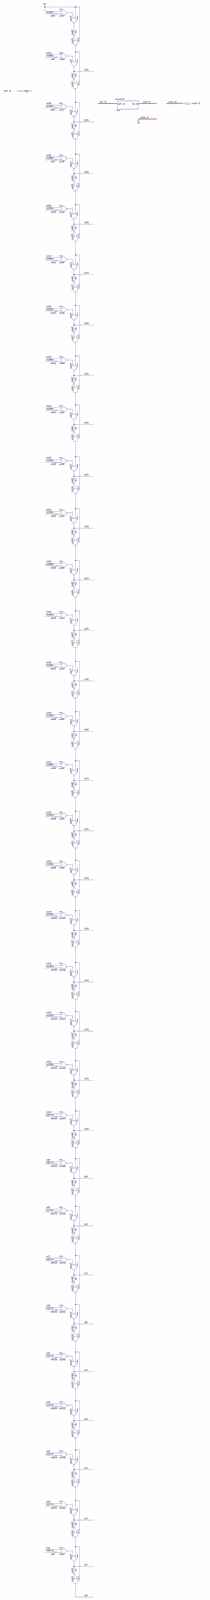
[diagram p0: schematic sheet, whole]
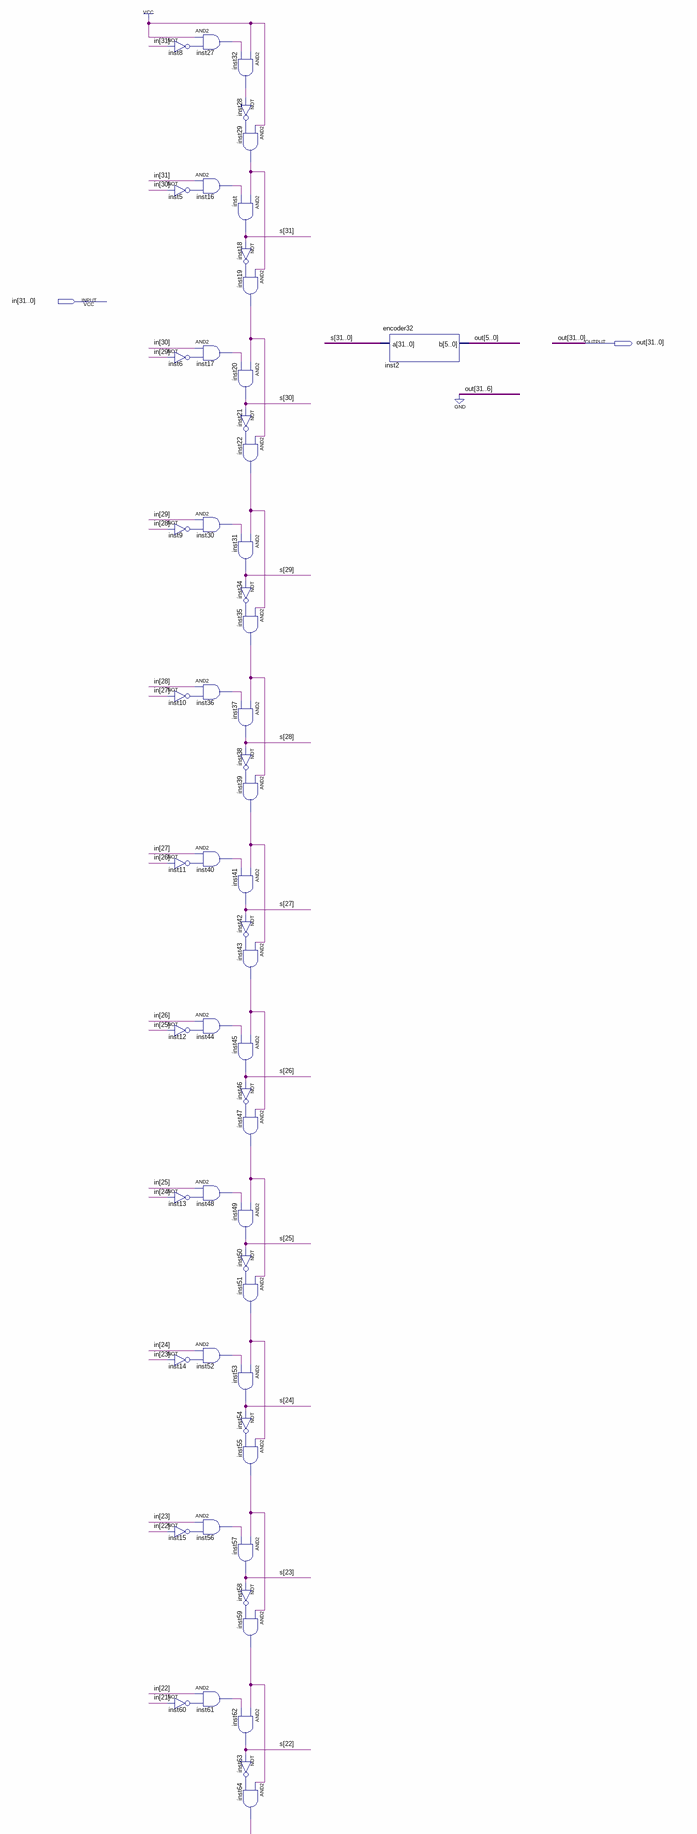
[diagram p1: schematic sheet, upper part]
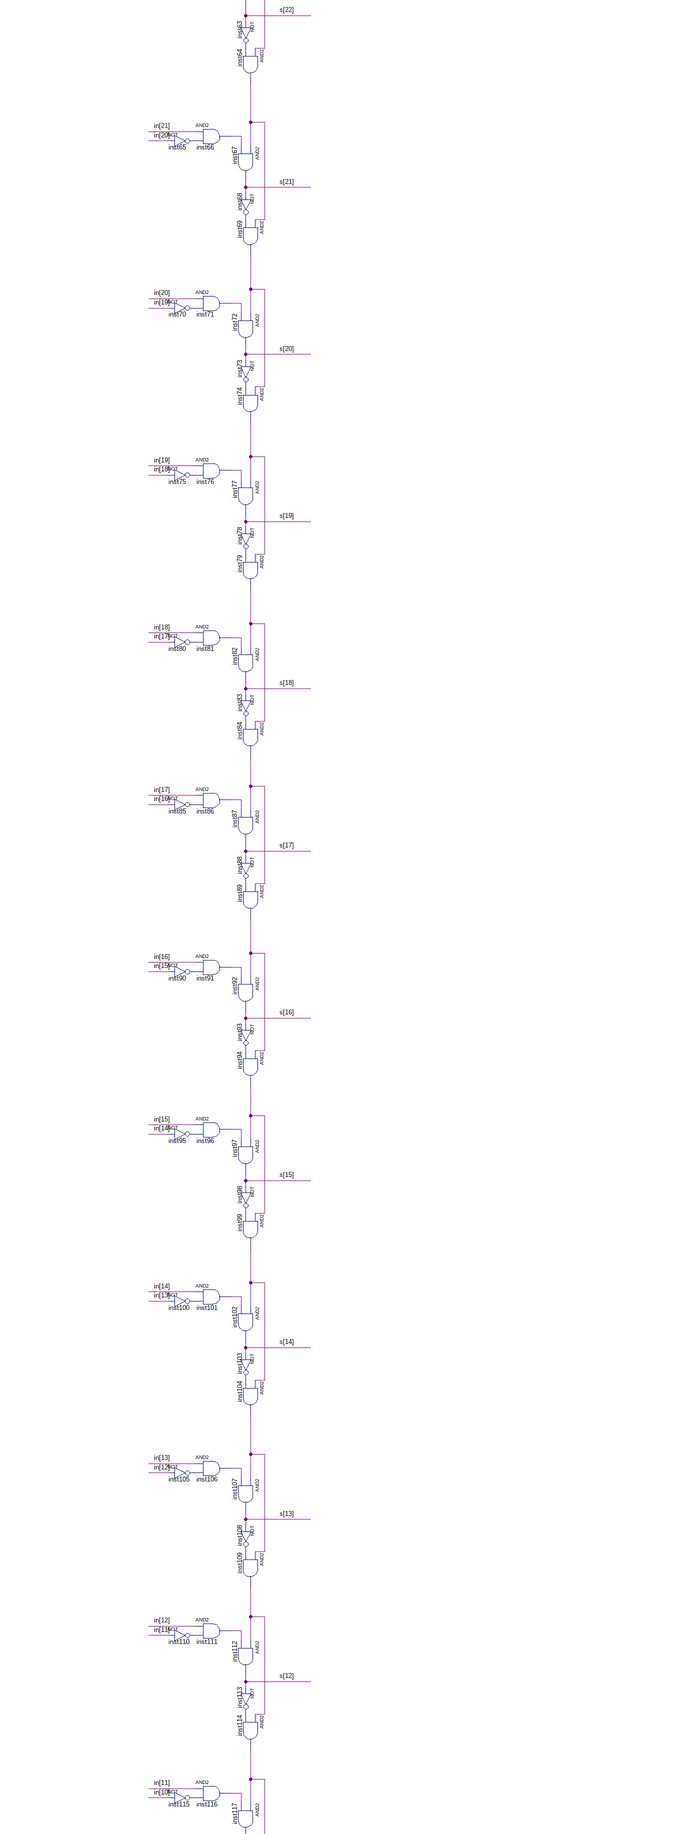
[diagram p2: schematic sheet, middle part]
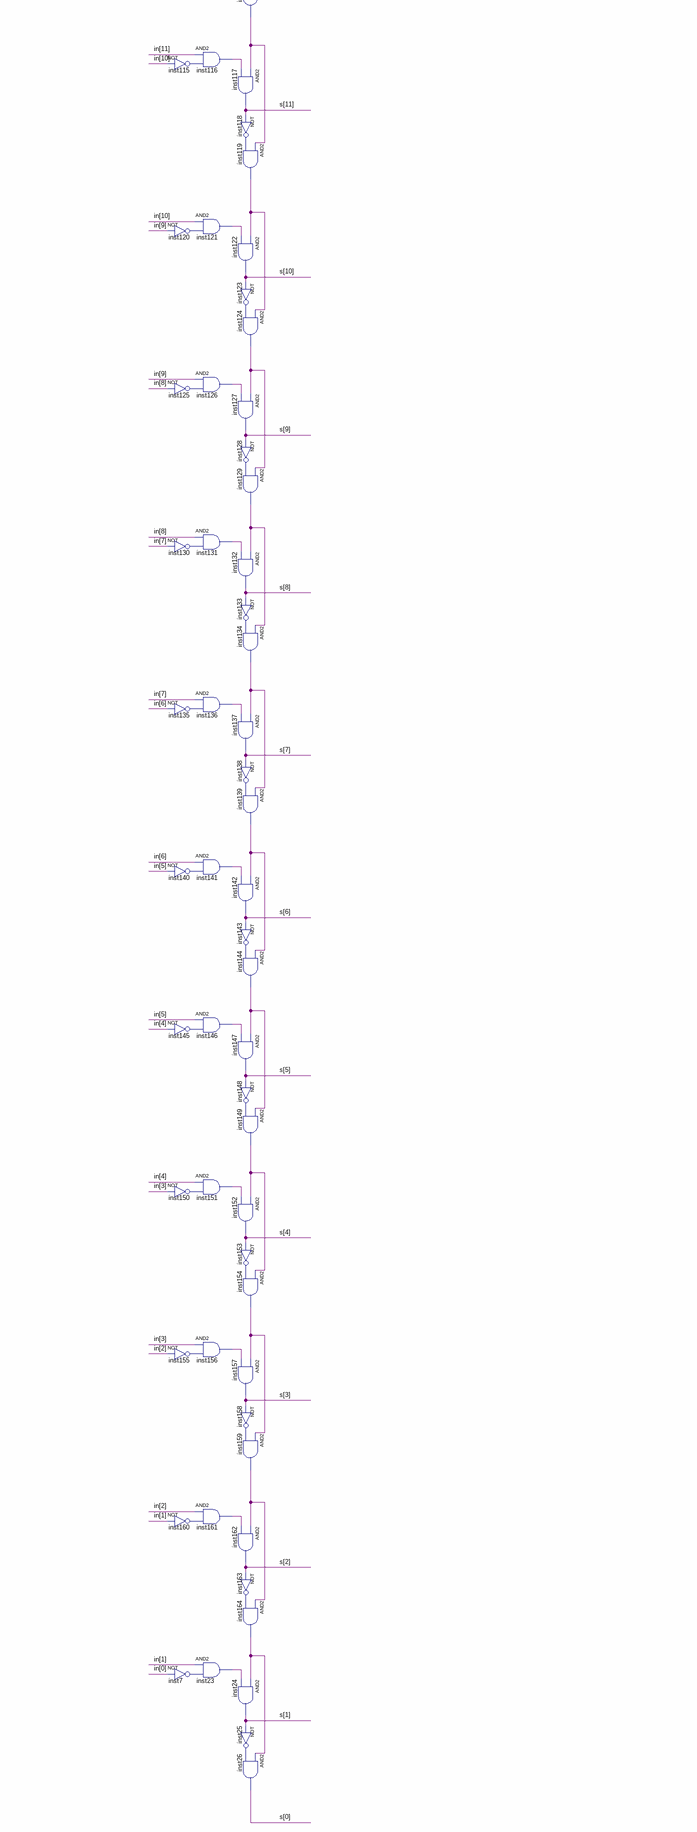
[diagram p3: schematic sheet, lower part]
// Quartus schematic clo.bdf as structural Verilog: 161 symbols, 2 pins
module clo (
  input  [31:0] in,
  output [31:0] out
);

  wire inst5_out, inst6_out, inst7_out, inst8_out, inst9_out, inst10_out, inst11_out, inst12_out, inst13_out,
       inst14_out, inst15_out, inst16_out, inst17_out, inst18_out, inst19_out, inst21_out, inst22_out,
       inst23_out, inst25_out, inst27_out, inst28_out, inst29_out, inst30_out, inst32_out, inst34_out,
       inst35_out, inst36_out, inst38_out, inst39_out, inst40_out, inst42_out, inst43_out, inst44_out,
       inst46_out, inst47_out, inst48_out, inst50_out, inst51_out, inst52_out, inst54_out, inst55_out,
       inst56_out, inst58_out, inst59_out, inst60_out, inst61_out, inst63_out, inst64_out, inst65_out,
       inst66_out, inst68_out, inst69_out, inst70_out, inst71_out, inst73_out, inst74_out, inst75_out,
       inst76_out, inst78_out, inst79_out, inst80_out, inst81_out, inst83_out, inst84_out, inst85_out,
       inst86_out, inst88_out, inst89_out, inst90_out, inst91_out, inst93_out, inst94_out, inst95_out,
       inst96_out, inst98_out, inst99_out, inst100_out, inst101_out, inst103_out, inst104_out, inst105_out,
       inst106_out, inst108_out, inst109_out, inst110_out, inst111_out, inst113_out, inst114_out,
       inst115_out, inst116_out, inst118_out, inst119_out, inst120_out, inst121_out, inst123_out,
       inst124_out, inst125_out, inst126_out, inst128_out, inst129_out, inst130_out, inst131_out,
       inst133_out, inst134_out, inst135_out, inst136_out, inst138_out, inst139_out, inst140_out,
       inst141_out, inst143_out, inst144_out, inst145_out, inst146_out, inst148_out, inst149_out,
       inst150_out, inst151_out, inst153_out, inst154_out, inst155_out, inst156_out, inst158_out,
       inst159_out, inst160_out, inst161_out, inst163_out, inst164_out;
  wire [31:0] s;

  not inst8 (inst8_out, in[31]);
  not inst5 (inst5_out, in[30]);
  not inst6 (inst6_out, in[29]);
  not inst9 (inst9_out, in[28]);
  not inst10 (inst10_out, in[27]);
  not inst11 (inst11_out, in[26]);
  not inst12 (inst12_out, in[25]);
  not inst13 (inst13_out, in[24]);
  not inst14 (inst14_out, in[23]);
  not inst15 (inst15_out, in[22]);
  not inst60 (inst60_out, in[21]);
  not inst65 (inst65_out, in[20]);
  not inst70 (inst70_out, in[19]);
  not inst75 (inst75_out, in[18]);
  not inst80 (inst80_out, in[17]);
  not inst85 (inst85_out, in[16]);
  not inst90 (inst90_out, in[15]);
  not inst95 (inst95_out, in[14]);
  not inst100 (inst100_out, in[13]);
  not inst105 (inst105_out, in[12]);
  not inst110 (inst110_out, in[11]);
  not inst115 (inst115_out, in[10]);
  not inst120 (inst120_out, in[9]);
  not inst125 (inst125_out, in[8]);
  not inst130 (inst130_out, in[7]);
  not inst135 (inst135_out, in[6]);
  not inst140 (inst140_out, in[5]);
  not inst145 (inst145_out, in[4]);
  not inst150 (inst150_out, in[3]);
  not inst155 (inst155_out, in[2]);
  not inst160 (inst160_out, in[1]);
  not inst7 (inst7_out, in[0]);
  and inst27 (inst27_out, 1'b1, inst8_out);
  and inst16 (inst16_out, in[31], inst5_out);
  and inst17 (inst17_out, in[30], inst6_out);
  and inst30 (inst30_out, in[29], inst9_out);
  and inst36 (inst36_out, in[28], inst10_out);
  and inst40 (inst40_out, in[27], inst11_out);
  and inst44 (inst44_out, in[26], inst12_out);
  and inst48 (inst48_out, in[25], inst13_out);
  and inst52 (inst52_out, in[24], inst14_out);
  and inst56 (inst56_out, in[23], inst15_out);
  and inst61 (inst61_out, in[22], inst60_out);
  and inst66 (inst66_out, in[21], inst65_out);
  and inst71 (inst71_out, in[20], inst70_out);
  and inst76 (inst76_out, in[19], inst75_out);
  and inst81 (inst81_out, in[18], inst80_out);
  and inst86 (inst86_out, in[17], inst85_out);
  and inst91 (inst91_out, in[16], inst90_out);
  and inst96 (inst96_out, in[15], inst95_out);
  and inst101 (inst101_out, in[14], inst100_out);
  and inst106 (inst106_out, in[13], inst105_out);
  and inst111 (inst111_out, in[12], inst110_out);
  and inst116 (inst116_out, in[11], inst115_out);
  and inst121 (inst121_out, in[10], inst120_out);
  and inst126 (inst126_out, in[9], inst125_out);
  and inst131 (inst131_out, in[8], inst130_out);
  and inst136 (inst136_out, in[7], inst135_out);
  and inst141 (inst141_out, in[6], inst140_out);
  and inst146 (inst146_out, in[5], inst145_out);
  and inst151 (inst151_out, in[4], inst150_out);
  and inst156 (inst156_out, in[3], inst155_out);
  and inst161 (inst161_out, in[2], inst160_out);
  and inst23 (inst23_out, in[1], inst7_out);
  and inst32 (inst32_out, 1'b1, inst27_out);
  not inst28 (inst28_out, inst32_out);
  and inst29 (inst29_out, 1'b1, inst28_out);
  and inst (s[31], inst29_out, inst16_out);
  not inst18 (inst18_out, s[31]);
  and inst19 (inst19_out, inst29_out, inst18_out);
  and inst20 (s[30], inst19_out, inst17_out);
  not inst21 (inst21_out, s[30]);
  and inst22 (inst22_out, inst19_out, inst21_out);
  and inst31 (s[29], inst22_out, inst30_out);
  not inst34 (inst34_out, s[29]);
  and inst35 (inst35_out, inst22_out, inst34_out);
  and inst37 (s[28], inst35_out, inst36_out);
  not inst38 (inst38_out, s[28]);
  and inst39 (inst39_out, inst35_out, inst38_out);
  and inst41 (s[27], inst39_out, inst40_out);
  not inst42 (inst42_out, s[27]);
  and inst43 (inst43_out, inst39_out, inst42_out);
  and inst45 (s[26], inst43_out, inst44_out);
  not inst46 (inst46_out, s[26]);
  and inst47 (inst47_out, inst43_out, inst46_out);
  and inst49 (s[25], inst47_out, inst48_out);
  not inst50 (inst50_out, s[25]);
  and inst51 (inst51_out, inst47_out, inst50_out);
  and inst53 (s[24], inst51_out, inst52_out);
  not inst54 (inst54_out, s[24]);
  and inst55 (inst55_out, inst51_out, inst54_out);
  and inst57 (s[23], inst55_out, inst56_out);
  not inst58 (inst58_out, s[23]);
  and inst59 (inst59_out, inst55_out, inst58_out);
  and inst62 (s[22], inst59_out, inst61_out);
  not inst63 (inst63_out, s[22]);
  and inst64 (inst64_out, inst59_out, inst63_out);
  and inst67 (s[21], inst64_out, inst66_out);
  not inst68 (inst68_out, s[21]);
  and inst69 (inst69_out, inst64_out, inst68_out);
  and inst72 (s[20], inst69_out, inst71_out);
  not inst73 (inst73_out, s[20]);
  and inst74 (inst74_out, inst69_out, inst73_out);
  and inst77 (s[19], inst74_out, inst76_out);
  not inst78 (inst78_out, s[19]);
  and inst79 (inst79_out, inst74_out, inst78_out);
  and inst82 (s[18], inst79_out, inst81_out);
  not inst83 (inst83_out, s[18]);
  and inst84 (inst84_out, inst79_out, inst83_out);
  and inst87 (s[17], inst84_out, inst86_out);
  not inst88 (inst88_out, s[17]);
  and inst89 (inst89_out, inst84_out, inst88_out);
  and inst92 (s[16], inst89_out, inst91_out);
  not inst93 (inst93_out, s[16]);
  and inst94 (inst94_out, inst89_out, inst93_out);
  and inst97 (s[15], inst94_out, inst96_out);
  not inst98 (inst98_out, s[15]);
  and inst99 (inst99_out, inst94_out, inst98_out);
  and inst102 (s[14], inst99_out, inst101_out);
  not inst103 (inst103_out, s[14]);
  and inst104 (inst104_out, inst99_out, inst103_out);
  and inst107 (s[13], inst104_out, inst106_out);
  not inst108 (inst108_out, s[13]);
  and inst109 (inst109_out, inst104_out, inst108_out);
  and inst112 (s[12], inst109_out, inst111_out);
  not inst113 (inst113_out, s[12]);
  and inst114 (inst114_out, inst109_out, inst113_out);
  and inst117 (s[11], inst114_out, inst116_out);
  not inst118 (inst118_out, s[11]);
  and inst119 (inst119_out, inst114_out, inst118_out);
  and inst122 (s[10], inst119_out, inst121_out);
  not inst123 (inst123_out, s[10]);
  and inst124 (inst124_out, inst119_out, inst123_out);
  and inst127 (s[9], inst124_out, inst126_out);
  not inst128 (inst128_out, s[9]);
  and inst129 (inst129_out, inst124_out, inst128_out);
  and inst132 (s[8], inst129_out, inst131_out);
  not inst133 (inst133_out, s[8]);
  and inst134 (inst134_out, inst129_out, inst133_out);
  and inst137 (s[7], inst134_out, inst136_out);
  not inst138 (inst138_out, s[7]);
  and inst139 (inst139_out, inst134_out, inst138_out);
  and inst142 (s[6], inst139_out, inst141_out);
  not inst143 (inst143_out, s[6]);
  and inst144 (inst144_out, inst139_out, inst143_out);
  and inst147 (s[5], inst144_out, inst146_out);
  not inst148 (inst148_out, s[5]);
  and inst149 (inst149_out, inst144_out, inst148_out);
  and inst152 (s[4], inst149_out, inst151_out);
  not inst153 (inst153_out, s[4]);
  and inst154 (inst154_out, inst149_out, inst153_out);
  and inst157 (s[3], inst154_out, inst156_out);
  not inst158 (inst158_out, s[3]);
  and inst159 (inst159_out, inst154_out, inst158_out);
  and inst162 (s[2], inst159_out, inst161_out);
  not inst163 (inst163_out, s[2]);
  and inst164 (inst164_out, inst159_out, inst163_out);
  and inst24 (s[1], inst164_out, inst23_out);
  not inst25 (inst25_out, s[1]);
  and inst26 (s[0], inst164_out, inst25_out);
  encoder32 inst2 (.a(s), .b(out[5:0]));

  assign out[31:6] = {26{1'b0}};
endmodule
